# EAGLE design bottom_board_v6 (EAGLE 9.6.2)
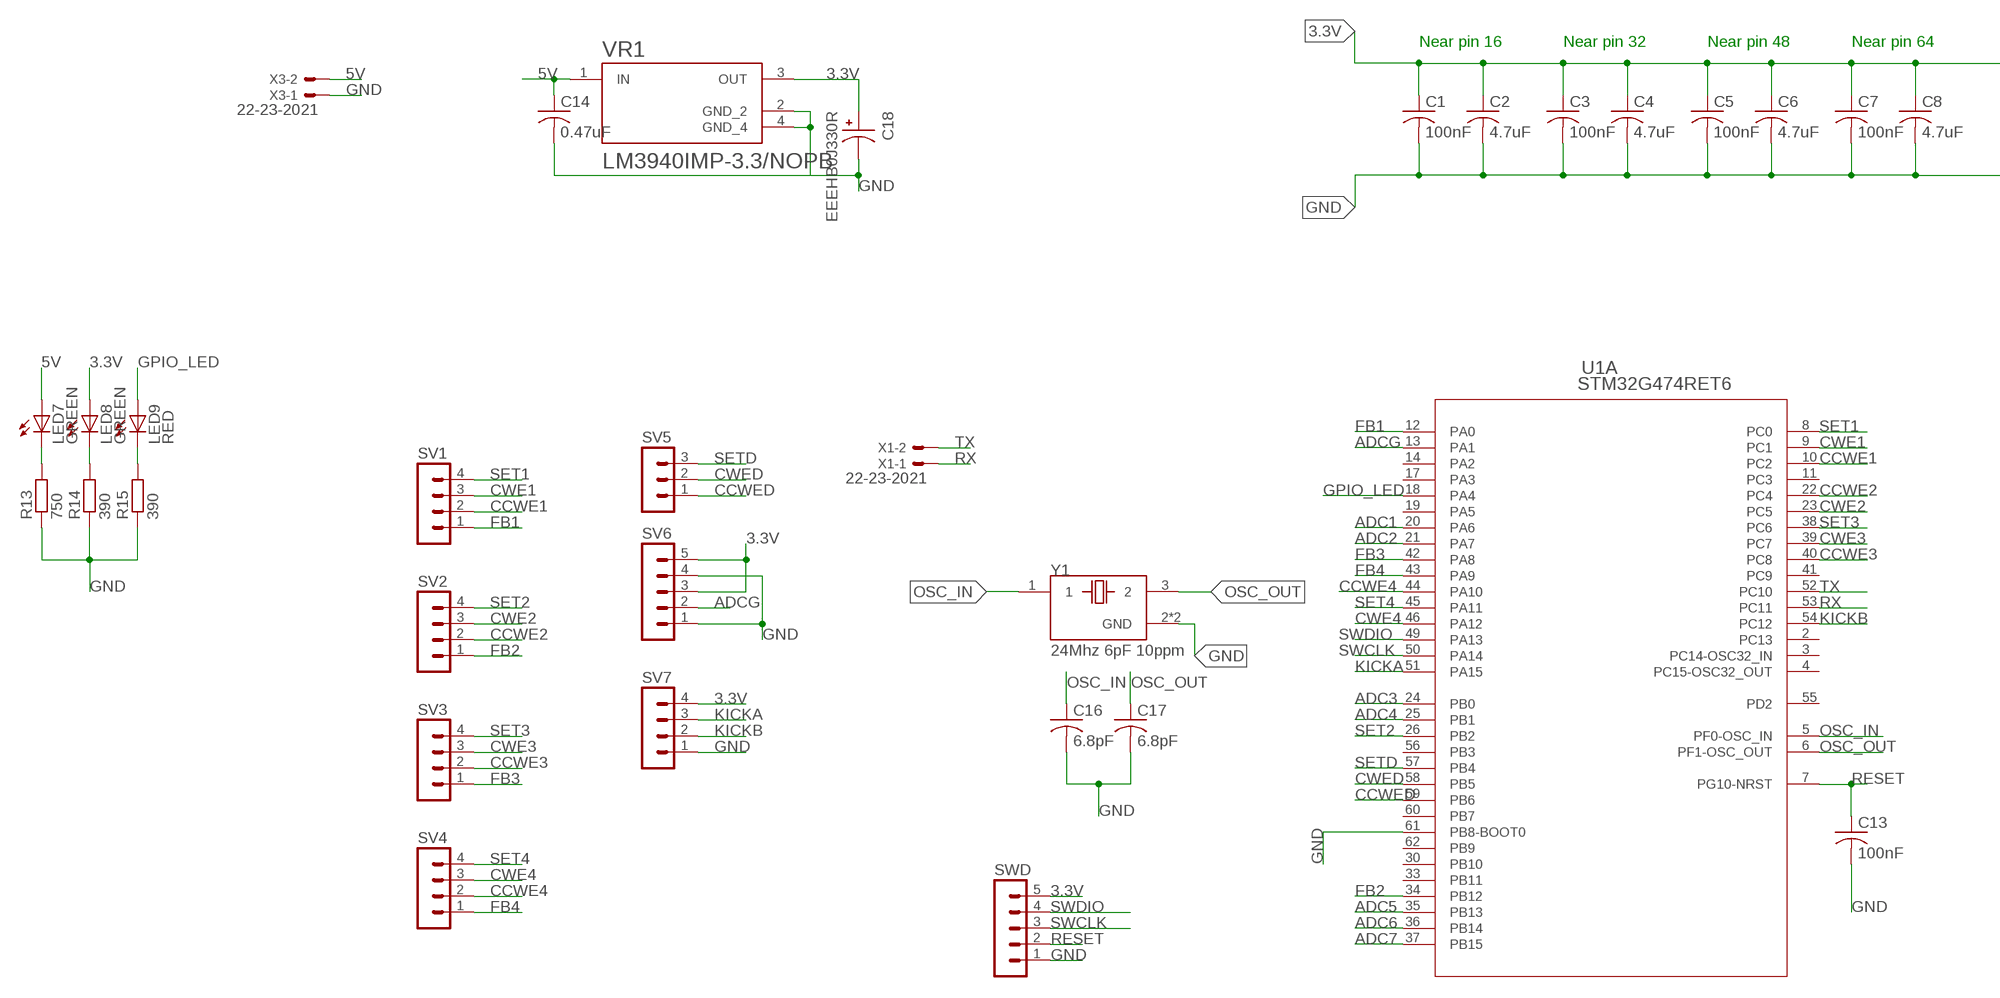
[diagram p0: schematic, sheet 1, part 1 of 2]
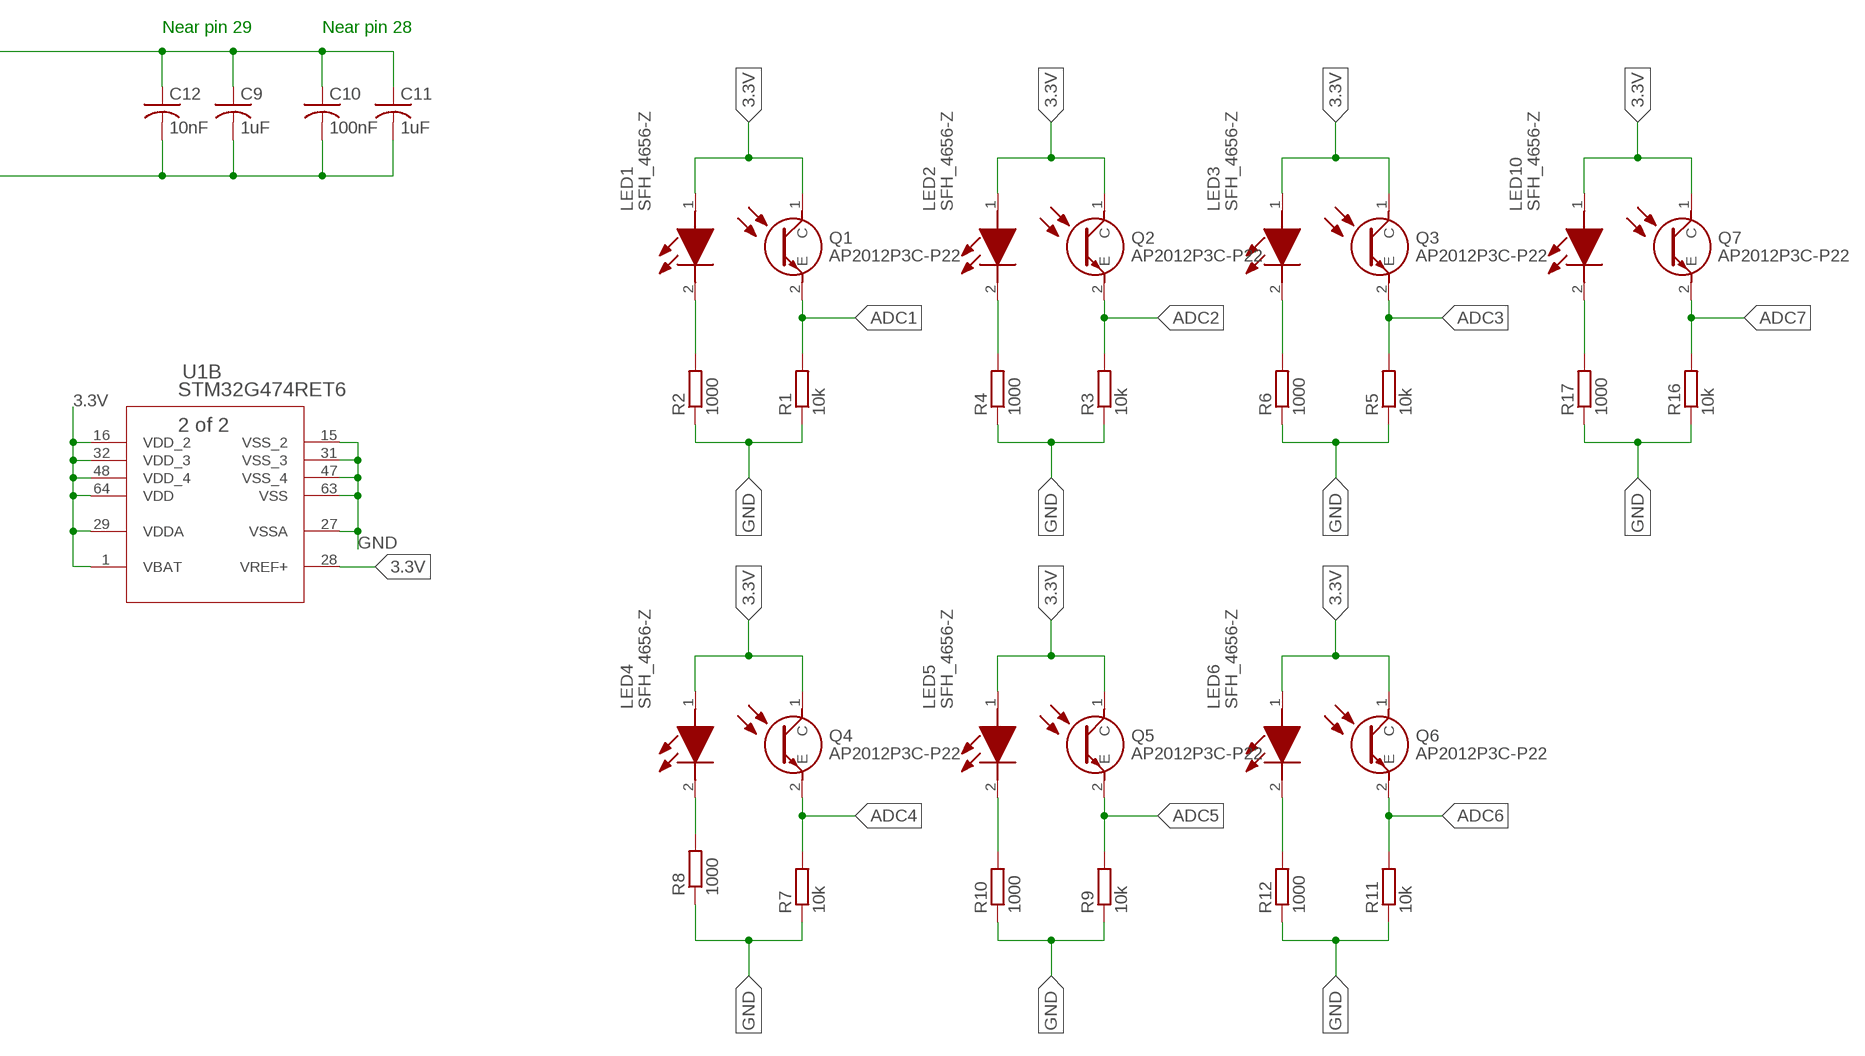
[diagram p1: schematic, sheet 1, part 2 of 2]

## Parts
C1  100nF  C-USC0603  [C0603]
C2  4.7uF  C-USC0603  [C0603]
C3  100nF  C-USC0603  [C0603]
C4  4.7uF  C-USC0603  [C0603]
C5  100nF  C-USC0603  [C0603]
C6  4.7uF  C-USC0603  [C0603]
C7  100nF  C-USC0603  [C0603]
C8  4.7uF  C-USC0603  [C0603]
C9  1uF  C-USC0603  [C0603]
C10  100nF  C-USC0603  [C0603]
C11  1uF  C-USC0603  [C0603]
C12  10nF  C-USC0603  [C0603]
C13  100nF  C-USC0603  [C0603]
C14  0.47uF  C-USC0603  [C0603]
C16  6.8pF  C-USC0603  [C0603]
C17  6.8pF  C-USC0603  [C0603]
C18  EEEHB0J330R  [CAP_EEEHB0J330R]
LED1  SFH_4656-Z  [SFH4656Z]
LED2  SFH_4656-Z  [SFH4656Z]
LED3  SFH_4656-Z  [SFH4656Z]
LED4  SFH_4656-Z  [SFH4656Z]
LED5  SFH_4656-Z  [SFH4656Z]
LED6  SFH_4656-Z  [SFH4656Z]
LED7  GREEN  LEDCHIPLED_0603  [CHIPLED_0603]
LED8  GREEN  LEDCHIPLED_0603  [CHIPLED_0603]
LED9  RED  LEDCHIPLED_0603  [CHIPLED_0603]
LED10  SFH_4656-Z  [SFH4656Z]
Q1  AP2012P3C-P22  [AP2012P3CP22]
Q2  AP2012P3C-P22  [AP2012P3CP22]
Q3  AP2012P3C-P22  [AP2012P3CP22]
Q4  AP2012P3C-P22  [AP2012P3CP22]
Q5  AP2012P3C-P22  [AP2012P3CP22]
Q6  AP2012P3C-P22  [AP2012P3CP22]
Q7  AP2012P3C-P22  [AP2012P3CP22]
R1  10k  R-EU_R0603  [R0603]
R2  1000  R-EU_R0603  [R0603]
R3  10k  R-EU_R0603  [R0603]
R4  1000  R-EU_R0603  [R0603]
R5  10k  R-EU_R0603  [R0603]
R6  1000  R-EU_R0603  [R0603]
R7  10k  R-EU_R0603  [R0603]
R8  1000  R-EU_R0603  [R0603]
R9  10k  R-EU_R0603  [R0603]
R10  1000  R-EU_R0603  [R0603]
R11  10k  R-EU_R0603  [R0603]
R12  1000  R-EU_R0603  [R0603]
R13  750  R-EU_R0603  [R0603]
R14  390  R-EU_R0603  [R0603]
R15  390  R-EU_R0603  [R0603]
R16  10k  R-EU_R0603  [R0603]
R17  1000  R-EU_R0603  [R0603]
SV1  MA04-1  [MA04-1]
SV2  MA04-1  [MA04-1]
SV3  MA04-1  [MA04-1]
SV4  MA04-1  [MA04-1]
SV5  MA03-1  [MA03-1]
SV6  MA05-1  [MA05-1]
SV7  MA04-1  [MA04-1]
SWD  MA05-1  [MA05-1]
U1  STM32G474RET6  [LQFP64-10X10MM]
VR1  LM3940IMP-3.3/NOPB  [VREG_LM3940IMP-3.3/NOPB]
X1  22-23-2021  [22-23-2021]
X3  22-23-2021  [22-23-2021]
Y1  24Mhz 6pF 10ppm  TSX-3225_16.0000MF18X-AC3  [XTAL_TSX-3225_16.0000MF18X-AC3]

## Nets
3.3V: C1.1 C2.1 C3.1 C4.1 C5.1 C6.1 C7.1 C8.1 C9.1 C10.1 C11.1 C12.1 C18.1 LED1.1(A) LED2.1(A) LED3.1(A) LED4.1(A) LED5.1(A) LED6.1(A) LED8.A LED10.1(A) Q1.1(C) Q2.1(C) Q3.1(C) Q4.1(C) Q5.1(C) Q6.1(C) Q7.1(C) SV6.3 SV6.5 SV7.4 SWD.5 U1.1(B:VBAT) U1.16(B:VDD_2) U1.28(B:VREF+) U1.29(B:VDDA) U1.32(B:VDD_3) U1.48(B:VDD_4) U1.64(B:VDD) VR1.3(OUT)
5V: C14.1 LED7.A VR1.1(IN) X3.2
ADC1: Q1.2(E) R1.2 U1.20(A:PA6)
ADC2: Q2.2(E) R3.2 U1.21(A:PA7)
ADC3: Q3.2(E) R5.2 U1.24(A:PB0)
ADC4: Q4.2(E) R7.2 U1.25(A:PB1)
ADC5: Q5.2(E) R9.2 U1.35(A:PB13)
ADC6: Q6.2(E) R11.2 U1.36(A:PB14)
ADC7: Q7.2(E) R16.2 U1.37(A:PB15)
ADCG: SV6.2 U1.13(A:PA1)
CCWE1: SV1.2 U1.10(A:PC2)
CCWE2: SV2.2 U1.22(A:PC4)
CCWE3: SV3.2 U1.40(A:PC8)
CCWE4: SV4.2 U1.44(A:PA10)
CCWED: SV5.1 U1.59(A:PB6)
CWE1: SV1.3 U1.9(A:PC1)
CWE2: SV2.3 U1.23(A:PC5)
CWE3: SV3.3 U1.39(A:PC7)
CWE4: SV4.3 U1.46(A:PA12)
CWED: SV5.2 U1.58(A:PB5)
FB1: SV1.1 U1.12(A:PA0)
FB2: SV2.1 U1.34(A:PB12)
FB3: SV3.1 U1.42(A:PA8)
FB4: SV4.1 U1.43(A:PA9)
GND: C1.2 C2.2 C3.2 C4.2 C5.2 C6.2 C7.2 C8.2 C9.2 C10.2 C11.2 C12.2 C13.2 C14.2 C16.2 C17.2 C18.2 R1.1 R2.1 R3.1 R4.1 R5.1 R6.1 R7.1 R8.1 R9.1 R10.1 R11.1 R12.1 R13.1 R14.1 R15.1 R16.1 R17.1 SV6.1 SV6.4 SV7.1 SWD.1 U1.15(B:VSS_2) U1.27(B:VSSA) U1.31(B:VSS_3) U1.47(B:VSS_4) U1.61(A:PB8-BOOT0) U1.63(B:VSS) VR1.2(GND_2) VR1.4(GND_4) X3.1 Y1.2(GND) Y1.4(GND)
GPIO_LED: LED9.A U1.18(A:PA4)
KICKA: SV7.3 U1.51(A:PA15)
KICKB: SV7.2 U1.54(A:PC12)
N$1: LED2.2(K) R4.2
N$2: LED3.2(K) R6.2
N$3: LED1.2(K) R2.2
N$4: LED4.2(K) R8.2
N$5: LED5.2(K) R10.2
N$6: LED6.2(K) R12.2
N$7: LED7.C R13.2
N$8: LED8.C R14.2
N$9: LED9.C R15.2
N$10: LED10.2(K) R17.2
OSC_IN: C16.1 U1.5(A:PF0-OSC_IN) Y1.1
OSC_OUT: C17.1 U1.6(A:PF1-OSC_OUT) Y1.3
RESET: C13.1 SWD.2 U1.7(A:PG10-NRST)
RX: U1.53(A:PC11) X1.1
SET1: SV1.4 U1.8(A:PC0)
SET2: SV2.4 U1.26(A:PB2)
SET3: SV3.4 U1.38(A:PC6)
SET4: SV4.4 U1.45(A:PA11)
SETD: SV5.3 U1.57(A:PB4)
SWCLK: SWD.3 U1.50(A:PA14)
SWDIO: SWD.4 U1.49(A:PA13)
TX: U1.52(A:PC10) X1.2
Unconnected: U1.2(A:PC13) U1.3(A:PC14-OSC32_IN) U1.4(A:PC15-OSC32_OUT) U1.11(A:PC3) U1.14(A:PA2) U1.17(A:PA3) U1.19(A:PA5) U1.30(A:PB10) U1.33(A:PB11) U1.41(A:PC9) U1.55(A:PD2) U1.56(A:PB3) U1.60(A:PB7) U1.62(A:PB9)

## Notes on the sheet
- Near pin 16 | Near pin 32 | Near pin 48 | Near pin 64 | Near pin 29 | Near pin 28

## Library data of the parts
C1-C14 C16 C17 = adafruit:C-US: CAPACITOR, American symbol
C18 = EEEHB0J330R:EEEHB0J330R: Check availability <https://pricing.snapeda.com/parts/EEE-HB0J330R/Panasonic/view-part?ref=eda>; AVAILABILITY: In Stock; CHECK_PRICES: https://www.snapeda.com/parts/EEE-HB0J330R/Panasonic/view-part/?ref=eda; DESCRIPTION: Capacitor,Alum Electrolytic,Cap 33 uF,Tol 20%,Vol-Rtg 6.3 VDC,SMT,4x5.8,TR | Panasonic Electronic Components EEE-HB0J330R; MF: Panasonic; MP: EEE-HB0J330R; PACKAGE: RADIAL-2 Panasonic; PRICE: None; SNAPEDA_LINK: https://www.snapeda.com/parts/EEE-HB0J330R/Panasonic/view-part/?ref=snap
LED1-LED6 LED10 = SFH_4656-Z:SFH_4656-Z: Infrared Emitters - High Power 850 nm MIDLED Source: Datasheet <https://dammedia.osram.info/media/resource/hires/osram-dam-16623498/SFH 4656_CN.pdf>; DESCRIPTION: Infrared Emitters - High Power 850 nm MIDLED; HEIGHT: 1.7mm; MANUFACTURER_NAME: OSRAM; MANUFACTURER_PART_NUMBER: SFH 4656-Z; MOUSER_PART_NUMBER: 720-SFH4656-Z; MOUSER_PRICE-STOCK: http://www.mouser.com/Search/ProductDetail.aspx?qs=KeLXQb9Uup2X3iF4LUEobw%3d%3d
LED7-LED9 = adafruit:LED: LED OSRAM: - CHIPLED LG R971, LG N971, LY N971, LG Q971, LY Q971, LO R971, LY R971 LH N974, LH R974 LS Q976, LO Q976, LY Q976 LO Q996 - Hyper CHIPLED LW Q18S LB Q993, LB Q99A, LB R99A - SideLED LS A670, LO A670, LY A670, LG A670, LP A670 LB A673, LV A673, LT A673, LW A673 LH A674 LY A675 LS A676, LA A676, LO A676, LY A676, LW A676 LS A679, LY A679, LG A679 - Hyper Micro SIDELED® LS Y876, LA Y876, LO Y876, LY Y876 LT Y87S - SmartLED LW L88C, LW L88S LB L89C, LB L89S, LG L890 LS L89K, LO L89K, LY L89K LS L896, LA L896, LO L896, LY L896 - TOPLED LS T670, LO T670, LY T670, LG T670, LP T670 LSG T670, LSP T670, LSY T670, LOP T670, LYG T670 LG T671, LOG T671, LSG T671 LB T673, LV T673, LT T673, LW T673 LH T674 LS T676, LA T676, LO T676, LY T676, LB T676, LH T676, LSB T676, LW T676 LB T67C, LV T67C, LT T67C, LS T67K, LO T67K, LY T67K, LW E67C LS E67B, LA E67B, LO E67B, LY E67B, LB E67C, LV E67C, LT E67C LW T67C LS T679, LY T679, LG T679 LS T770, LO T770, LY T770, LG T770, LP T770 LB T773, LV T773, LT T773, LW T773 LH T774 LS E675, LA E675, LY E675, LS T675 LS T776, LA T776, LO T776, LY T776, LB T776 LHGB T686 LT T68C, LB T68C - Hyper Mini TOPLED® LB M676 - Mini TOPLED Santana® LG M470 LS M47K, LO M47K, LY M47K Source: http://www.osram.convergy.de/
Q1-Q7 = AP2012P3C-P22:AP2012P3C-P22: Phototransistors 2x1.2mm PHOTOTRANS SMD LED Source: Datasheet <http://www.kingbrightusa.com/images/catalog/SPEC/AP2012P3C-P22.pdf>; ARROW_PART_NUMBER: AP2012P3C-P22; ARROW_PRICE-STOCK: https://www.arrow.com/en/products/ap2012p3c-p22/kingbright; DESCRIPTION: Phototransistors 2x1.2mm PHOTOTRANS SMD LED; HEIGHT: 1.1mm; MANUFACTURER_NAME: Kingbright; MANUFACTURER_PART_NUMBER: AP2012P3C-P22; MOUSER_PART_NUMBER: 604-AP2012P3C-P22; MOUSER_PRICE-STOCK: https://www.mouser.com/Search/Refine.aspx?Keyword=604-AP2012P3C-P22
R1-R17 = rcl:R-EU_: RESISTOR, European symbol; SPICEPREFIX: R
SV1-SV4 SV7 = con-lstb:MA04-1: PIN HEADER; OC_FARNELL: unknown; OC_NEWARK: unknown
SV5 = con-lstb:MA03-1: PIN HEADER; OC_FARNELL: unknown; OC_NEWARK: unknown
SV6 SWD = con-lstb:MA05-1: PIN HEADER; OC_FARNELL: unknown; OC_NEWARK: unknown
U1 = STM32G474RET6:STM32G474RET6; COPYRIGHT: Copyright (C) 2023 Ultra Librarian. All rights reserved.; MANUFACTURER_PART_NUMBER: STM32G474RET6; MFR_NAME: STMicroelectronics
VR1 = LM3940IMP-3.3_NOPB:LM3940IMP-3.3/NOPB: 1-A, low-dropout voltage regulator for 5-V to 3.3-V conversion 4-SOT-223 -40 to 125 Check availability <https://pricing.snapeda.com/parts/LM3940IMP-3.3/Texas%20Instruments/view-part?ref=eda>; AVAILABILITY: In Stock; CHECK_PRICES: https://www.snapeda.com/parts/LM3940IMP-3.3/Texas+Instruments/view-part/?ref=eda; DESCRIPTION: 1-A, low-dropout voltage regulator for 5-V to 3.3-V conversion 4-SOT-223 -40 to 125; MF: Texas Instruments; MP: LM3940IMP-3.3; PACKAGE: SOT-223-4 Texas Instruments; PRICE: None; PURCHASE-URL: https://www.snapeda.com/api/url_track_click_mouser/?unipart_id=50710&manufacturer=Texas Instruments&part_name=LM3940IMP-3.3&search_term=None; SNAPEDA_LINK: https://www.snapeda.com/parts/LM3940IMP-3.3/Texas+Instruments/view-part/?ref=snap
X1 X3 = con-molex:22-23-2021: .100" (2.54mm) Center Header - 2 Pin; MF: MOLEX; MPN: 22-23-2021; OC_FARNELL: 1462926; OC_NEWARK: 25C3832
Y1 = SMD3225:TSX-3225_16.0000MF18X-AC3: SMD Crystal 16MHz-9pF-10ppm-60R; Check availability <https://pricing.snapeda.com/parts/TSX-3225%2016.0000MF18X-AC3/EPSON/view-part?ref=eda>; AVAILABILITY: In Stock; CHECK_PRICES: https://www.snapeda.com/parts/TSX-3225%2016.0000MF18X-AC3/EPSON/view-part/?ref=eda; DESCRIPTION: 16 MHz ±10ppm Crystal 9pF 60 Ohms 4-SMD, No Lead; MF: EPSON; MP: TSX-3225 16.0000MF18X-AC3; PACKAGE: SMD-4 EPSON; PRICE: None; PURCHASE-URL: https://www.snapeda.com/api/url_track_click_mouser/?unipart_id=105674&manufacturer=EPSON&part_name=TSX-3225 16.0000MF18X-AC3&search_term=None; SNAPEDA_LINK: https://www.snapeda.com/parts/TSX-3225%2016.0000MF18X-AC3/EPSON/view-part/?ref=snap

## Board
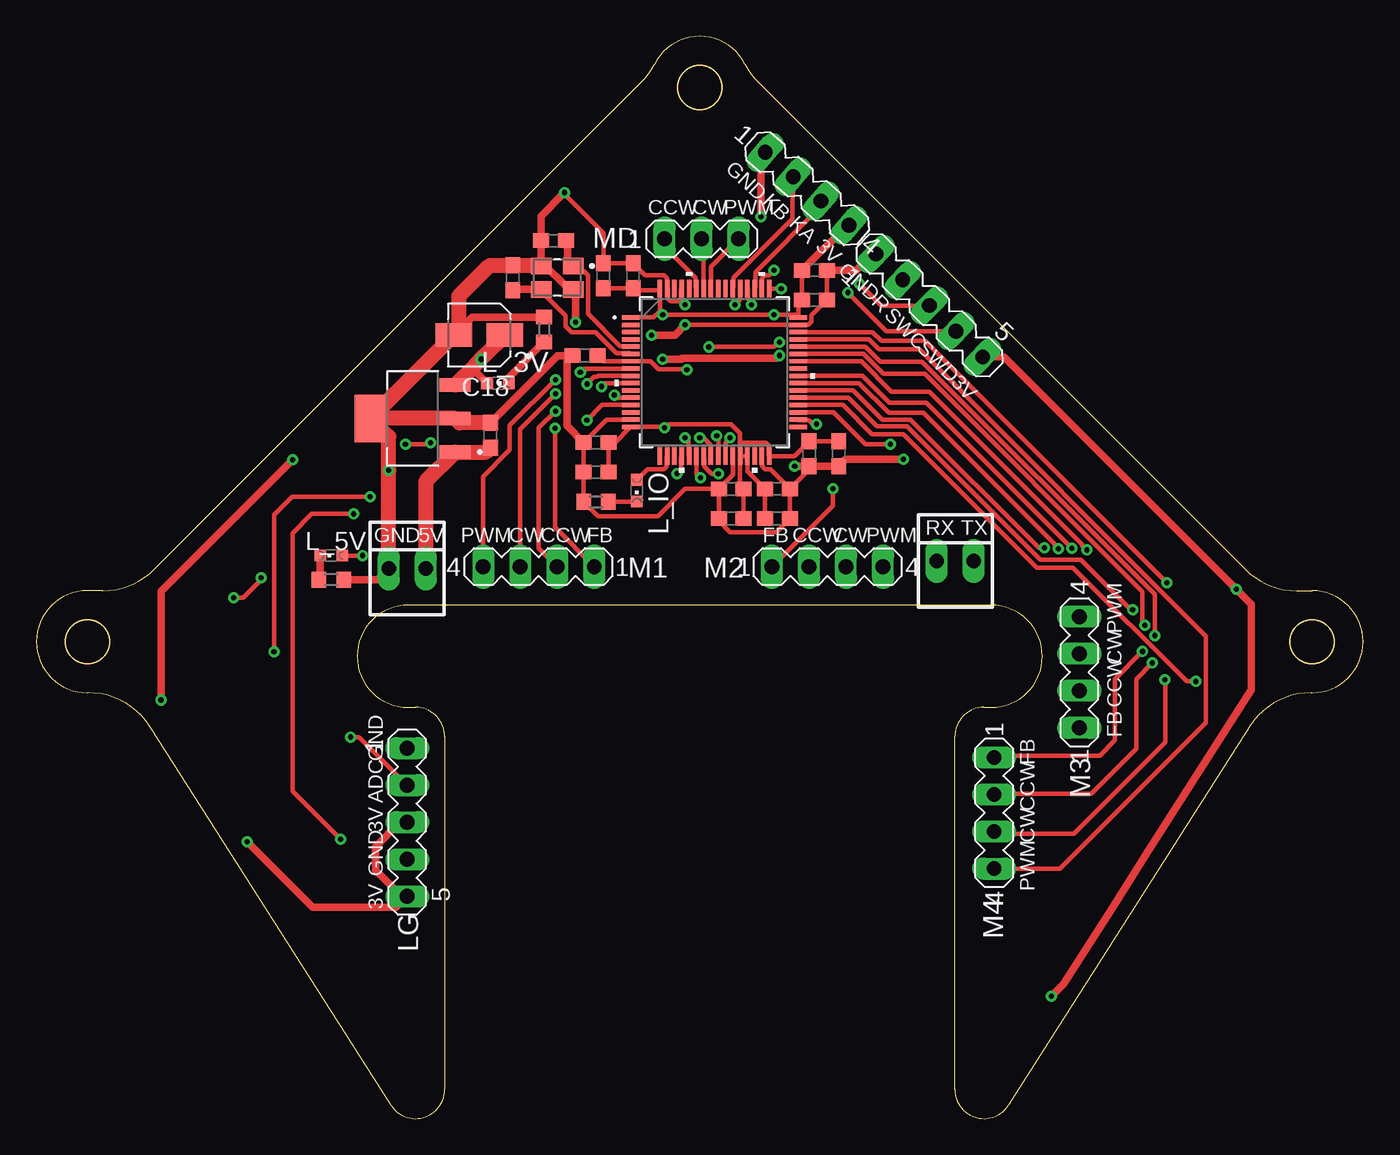
[diagram p2: board, top side]
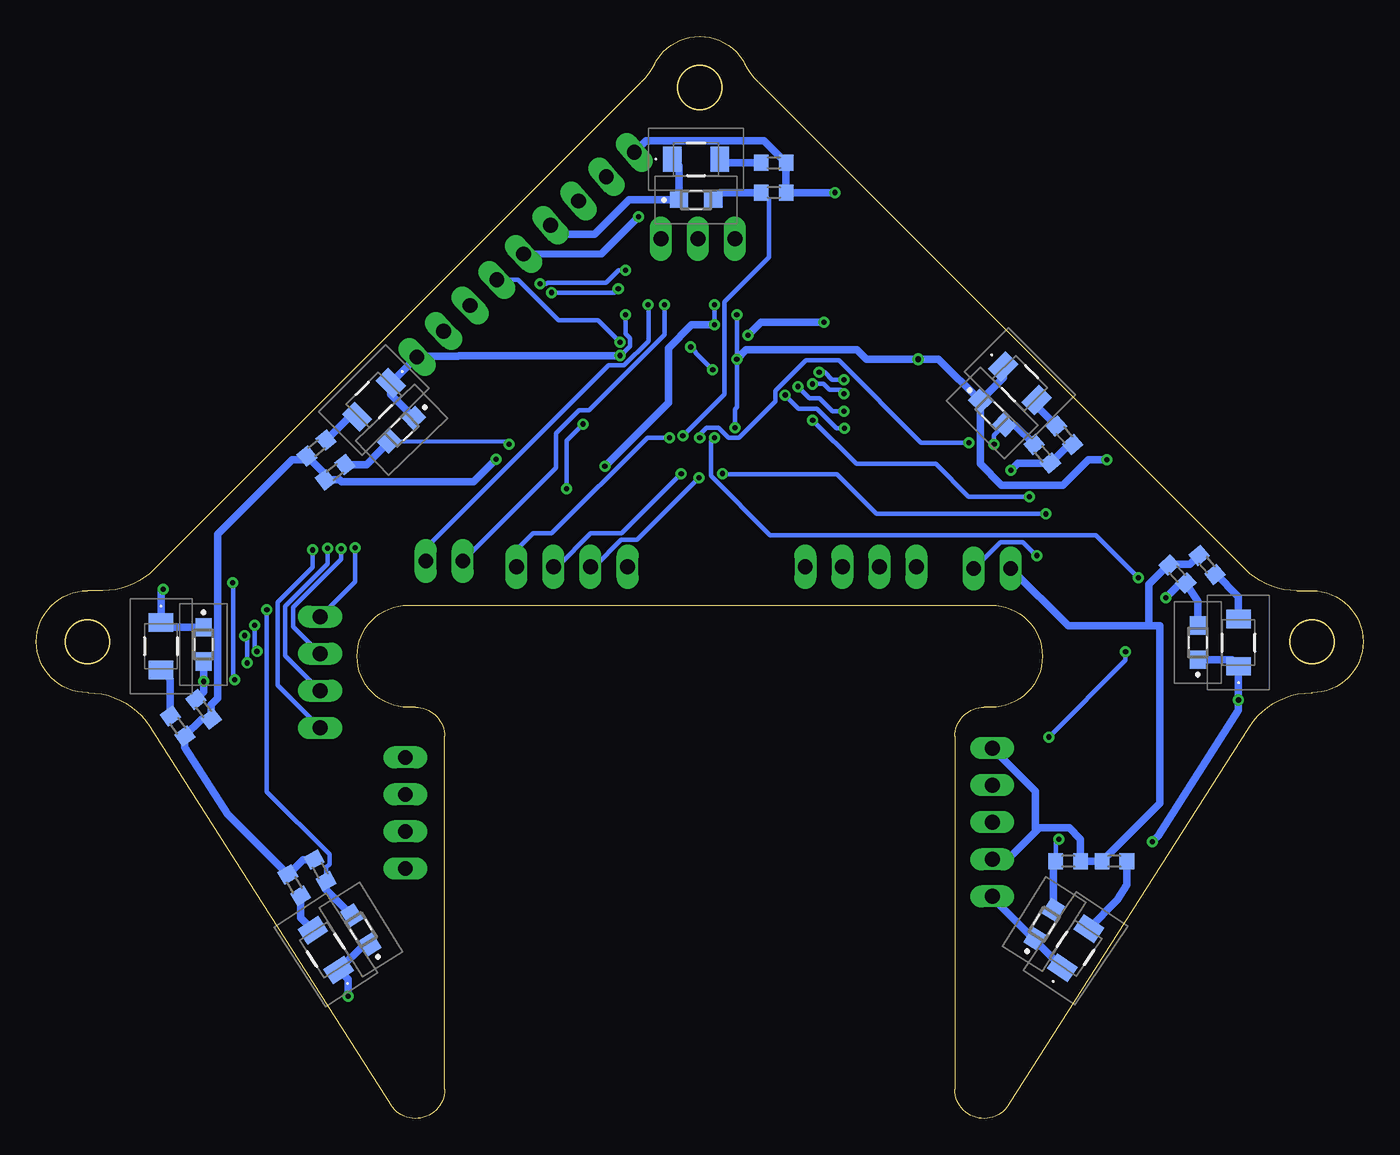
[diagram p3: board, bottom side, seen from below]

Size 91 x 74.2 mm. Coordinates in mm from the lower left corner, seen from the top.
Outline: 41.48,71.05 8.09,37.66 arc-45 4.55,36.2 3.5,36.2 arc180 3.5,29.2 3.56,29.2 arc-58 7.77,26.89 24.31,0.93 arc148 28,2 28,26.2 arc90 26,28.2 25.5,28.2 arc-180 25.5,35.2 65.5,35.2 arc-180 65.5,28.2 65,28.2 arc90 63,26.2 63,2 arc148 66.69,0.93 83.22,26.89 arc-58 87.44,29.2 87.5,29.2 arc180 87.5,36.2 86.44,36.2 arc-45 82.91,37.66 49.52,71.05 arc-18 48.61,72.3 arc126 42.39,72.3 arc-18 41.48,71.05
Outline: circle at 3.5,32.7 radius 1.5
Outline: circle at 45.5,70.7 radius 1.5
Outline: circle at 87.5,32.7 radius 1.5
Copper layers (1*16): Top 0.035mm / dielectric 1.5mm / Bottom 0.035mm
Design rules "default": minimum track width 6mil, minimum drill 0.35mm, track to track 6mil, track to pad 6mil, pad to pad 6mil, via to via 6mil, smd to smd 6mil, copper to edge 40mil, drill to drill 6mil, minimum pad ring 10mil, minimum via ring 8mil, stop-mask expansion 4mil, vias tented up to drill 0mil, thermal gap 10mil

### Footprints (pad centres in the part's own frame; a part is rotated, then mirrored left to right if it is on the bottom)
C0603 = smd 1.1 x 1: 1 -0.85,0; 2 0.85,0
CAP_EEEHB0J330R = smd 2.5 x 1.6: 1 -1.75,0; 2 1.75,0
SFH4656Z = smd 1.25 x 1.7: 1 -1.625,0; 2 1.625,0
CHIPLED_0603 = smd 0.8 x 0.8: A 0,-0.75; C 0,0.75
AP2012P3CP22 = smd 1.25 x 1.1: 1 -1.175,0; 2 1.175,0
R0603 = smd 1 x 1.1: 1 -0.85,0; 2 0.85,0
MA04-1 = drill 1.016 long: 1 -3.81,0; 2 -1.27,0; 3 1.27,0; 4 3.81,0
MA03-1 = drill 1.016 long: 1 -2.54,0; 2 0,0; 3 2.54,0
MA05-1 = drill 1.016 long: 1 -5.08,0; 2 -2.54,0; 3 0,0; 4 2.54,0; 5 5.08,0
LQFP64-10X10MM = smd 1.194 x 0.305: 1 -5.75,3.75; 2 -5.75,3.25; 3 -5.75,2.75; 4 -5.75,2.25; 5 -5.75,1.75; 6 -5.75,1.25; 7 -5.75,0.75; 8 -5.75,0.25; 9 -5.75,-0.25; 10 -5.75,-0.75; 11 -5.75,-1.25; 12 -5.75,-1.75; 13 -5.75,-2.25; 14 -5.75,-2.75; 15 -5.75,-3.25; 16 -5.75,-3.75; 33 5.75,-3.75; 34 5.75,-3.25; 35 5.75,-2.75; 36 5.75,-2.25; 37 5.75,-1.75; 38 5.75,-1.25; 39 5.75,-0.75; 40 5.75,-0.25; 41 5.75,0.25; 42 5.75,0.75; 43 5.75,1.25; 44 5.75,1.75; 45 5.75,2.25; 46 5.75,2.75; 47 5.75,3.25; 48 5.75,3.75 | smd 0.305 x 1.194: 17 -3.75,-5.75; 18 -3.25,-5.75; 19 -2.75,-5.75; 20 -2.25,-5.75; 21 -1.75,-5.75; 22 -1.25,-5.75; 23 -0.75,-5.75; 24 -0.25,-5.75; 25 0.25,-5.75; 26 0.75,-5.75; 27 1.25,-5.75; 28 1.75,-5.75; 29 2.25,-5.75; 30 2.75,-5.75; 31 3.25,-5.75; 32 3.75,-5.75; 49 3.75,5.75; 50 3.25,5.75; 51 2.75,5.75; 52 2.25,5.75; 53 1.75,5.75; 54 1.25,5.75; 55 0.75,5.75; 56 0.25,5.75; 57 -0.25,5.75; 58 -0.75,5.75; 59 -1.25,5.75; 60 -1.75,5.75; 61 -2.25,5.75; 62 -2.75,5.75; 63 -3.25,5.75; 64 -3.75,5.75
VREG_LM3940IMP-3.3/NOPB = smd 2.15 x 0.95: 1 -2.9,2.3; 2 -2.9,0; 3 -2.9,-2.3 | smd 2.15 x 3.25: 4 2.9,0
22-23-2021 = drill 1 long: 1 -1.27,0; 2 1.27,0
XTAL_TSX-3225_16.0000MF18X-AC3 = smd 1.4 x 1.15: 1 -1.1,-0.8; 2 1.1,-0.8; 3 1.1,0.8; 4 -1.1,0.8

### Placement (x,y rotation side)
C1  38.39,44.32 180 top
C2  38.39,46.35 180 top
C3  55.02,45.59 270 top
C4  52.99,45.59 270 top
C5  53.37,58.16 0 top
C6  53.37,56.13 0 top
C7  38.9,57.78 90 top
C8  40.93,57.78 90 top
C9  50.83,43.18 0 top
C10  50.83,41.14 0 top
C11  47.66,41.14 180 top
C12  47.66,43.18 180 top
C13  37.63,52.32 180 top
C14  31.15,46.86 90 top
C16  35.47,60.19 180 top
C17  32.67,57.65 90 top
C18  30.39,53.72 180 top
LED1  19.72,11.68 56 bottom
LED2  8.54,32.64 90 bottom
LED3  23.53,50.42 315 bottom
LED4  45.75,65.78 0 bottom
LED5  67.85,49.27 225 bottom
LED6  82.46,32.38 270 bottom
LED7  20.23,38.6 90 top
LED8  31.66,50.42 270 top
LED9  41.18,43.05 180 top
LED10  71.15,11.55 123 bottom
Q1  21.88,13.33 58 bottom
Q2  11.34,32.64 90 bottom
Q3  25.43,48.38 315 bottom
Q4  45.75,62.99 0 bottom
Q5  65.95,47.24 224 bottom
Q6  79.54,32.51 270 bottom
Q7  68.74,12.95 122 bottom
R1  20.23,17.65 180 bottom
R2  17.05,17.65 0 bottom
R3  12.73,37.33 313 bottom
R4  10.7,37.97 310 bottom
R5  22,45.59 131 bottom
R6  20.48,46.86 131 bottom
R7  40.42,63.5 180 bottom
R8  40.42,65.53 180 bottom
R9  70.52,44.32 38 bottom
R10  71.79,45.97 40 bottom
R11  79.54,28.06 128 bottom
R12  81.31,26.92 126 bottom
R13  20.23,36.95 180 top
R14  34.83,54.1 270 top
R15  38.39,42.29 0 top
R16  71.53,17.01 299 bottom
R17  73.31,16 301 bottom
SV1  34.45,37.84 180 top
SV2  54.26,37.84 0 top
SV3  71.53,30.6 90 top
SV4  65.69,20.95 270 top
SV5  45.63,60.32 0 top
SV6  25.43,20.32 270 top
SV7  52.87,63.75 319 top
SWD  61.25,55.75 316 top
U1  46.52,51.18 0 top
VR1  25.82,48 180 top
X1  63.03,38.22 0 top
X3  25.43,37.72 0 top
Y1  35.72,57.65 180 top

### Tracks (layer width: path | path; a pad name or v marks a point on that pad's centre or on a via)
3.3V  (via drill 0.35, 0.4)
  Top 0.305: C1.1 C2.1 39.69,46.35 U1.16 43.03,47.43 v43.09,47.37 43.34,47.62 47.64,47.62 48.27,47 48.27,46.36 | 48.27,46.36 U1.28 | U1.28 U1.29 48.77,44.39 C9.1 C10.1 | C11.1 C12.1 48.26,43.43 48.26,45.42 U1.28 | 48.27,46.36 48.3,46.33 50.05,46.33 50.22,46.15 50.22,45.47 U1.32 51.98,45.43 C4.1 C3.1 | 42.77,55.37 42.77,55.31 v42.96,55.11 v50.58,55.11 52.08,55.11 U1.48 52.27,55.87 C6.1 C5.1 | 42.77,55.37 U1.64 42.64,56.8 41.06,56.8 C8.1 C7.1 | 42.77,55.37 42.33,54.93 U1.1
  Top 0.508: v8.54,28.7 8.54,36.14 v17.58,45.18 | SV7.4 55.62,61.26 C5.1 | v42.96,52.07 44.23,52.07 44.29,52.12 50.76,52.12 v50.96,52.32 | SWD.5 66.39,52.21 v82.31,36.29 83.32,35.28 83.32,29.4 78.16,21.31 76.28,18.35 73.82,14.49 70.45,9.2 v69.63,8.38 | SV6.3 24.93,20.32 23.25,18.64 23.25,17.04 25.05,15.24 SV6.5 24.68,14.49 18.96,14.49 v14.46,18.99 | LED8.A 30.12,51.2 30.12,51.7 | v30.51,52.07 30.51,52.09 30.75,52.33
  Top 1.016: VR1.3 28.72,50.3 30.12,51.7 30.75,52.33 C18.1
  Bottom 0.305: v42.96,55.11 v42.96,52.07 42.96,48.76 43.09,48.64 v43.09,47.37 | v50.96,52.32 50.73,52.55 50.68,52.55 50.28,52.95 50.28,53.51 50.58,53.81 v50.58,55.11
  Bottom 0.508: LED1.1 22.5,12.21 | 22.5,12.21 Q1.1 | 20.79,10.16 LED1.1 | v14.46,18.99 14.05,19.4 8.56,28.01 | 8.56,28.01 | 8.56,28.01 8.54,28.03 v8.54,28.7 LED2.1 8.99,31.46 Q2.1 | Q3.1 24.68,50.8 LED3.1 | v17.58,45.18 18.85,45.18 20.61,43.43 24.8,43.43 26.27,44.9 Q3.1 | Q3.1 29.12,52.07 v30.51,52.07 34.07,52.07 34.7,52.7 42.33,52.7 v42.96,52.07 | Q7.1 68.5,11.96 LED10.1 69.63,9.55 v69.63,8.38 | LED4.1 46.93,65.33 Q4.1 50.36,62.99 52.7,60.64 55.08,60.64 SV7.4 | v50.96,52.32 62,52.32 62.07,52.26 64.84,52.26 SWD.5 64.92,52.21 LED5.1 66.7,49.66 Q5.1 | Q6.1 82.13,33.68 LED6.1 82.46,36.14 v82.31,36.29 | 20.62,9.89 LED1.1 | SV6.5 25.43,15.14 22.5,12.21
5V  (via drill 0.35)
  Top 0.305: LED7.A v22.39,38.6
  Top 1.016: X3.2 26.7,43.69 VR1.1 30.84,45.7 C14.1
  Bottom 0.305: v22.39,38.6 22.42,38.6 23.34,39.53 24.89,39.53 X3.2
ADC1  (via drill 0.35)
  Top 0.305: v43.94,44.23 44.22,44.51 44.22,45.38 U1.20 | v20.86,19.15 17.56,22.45 17.56,40.13 18.89,41.45 v21.75,41.45
  Bottom 0.305: R1.2 21.08,18.94 v20.86,19.15 | v21.75,41.45 33.36,41.45 36.1,44.19 43.9,44.19 v43.94,44.23
  Bottom 0.508: Q1.2 21.25,17.47 R1.2
ADC2  (via drill 0.35)
  Top 0.305: v13.54,35.7 14.18,35.7 15.4,36.93 v15.4,37.09 | v44.48,46.68 44.74,46.43 44.74,45.46 U1.21
  Bottom 0.305: v15.4,37.09 18.32,40.01 40.69,40.01 44.74,44.06 44.74,46.43 v44.48,46.68
  Bottom 0.508: Q2.2 11.34,35.48 R3.2 12.53,36.71 v13.54,35.7
ADC3  (via drill 0.35)
  Top 0.305: v25.31,46.22 26.92,46.22 v27.05,46.35 | v45.5,46.68 45.75,46.68 46.27,46.17 U1.24
  Bottom 0.305: Q3.2 25.31,46.85 v25.31,46.22 | v27.05,46.35 30.33,46.35 35.96,51.99 38.23,51.99 40.32,49.89 40.32,49.17 42.8,46.68 43.52,46.68 44.2,47.37 45.02,47.37 45.5,46.89 v45.5,46.68
  Bottom 0.508: R5.2 23.88,47.55 Q3.2
ADC4  (via drill 0.35)
  Top 0.305: U1.25 46.79,45.45 46.79,46.68 v46.66,46.81
  Bottom 0.305: R7.2 40.76,62.99 40.76,59.06 43.82,56 43.82,49.66 v46.66,46.81
  Bottom 0.508: R7.2 44.07,63.5 Q4.2
ADC5  (via drill 0.35)
  Top 0.305: v58.58,46.22 56.88,46.22 54.68,48.43 U1.35
  Bottom 0.305: Q5.2 58.77,46.42 v58.58,46.22
  Bottom 0.508: R9.2 68.36,44.84 Q5.2
ADC6  (via drill 0.35)
  Top 0.305: v79.54,29.97 78.9,29.97 71.09,37.78 68.61,37.78 59.47,46.92 57.32,46.92 55.32,48.93 U1.36
  Bottom 0.508: R11.2 79.54,29.26 v79.54,29.97 Q6.2
ADC7  (via drill 0.35)
  Top 0.305: U1.37 55.71,49.43 57.67,47.47 59.72,47.47 68.87,38.33 71.64,38.33 75.07,34.9 v75.19,34.9
  Bottom 0.305: 71.12,16 71.12,17.23 70.9,17.45 70.9,18.11 75.19,22.41 v75.19,34.9
  Bottom 0.508: Q7.2 71.12,15.69 71.12,16 R16.2
ADCG  (via drill 0.35)
  Top 0.305: U1.13 38.8,48.93 v37.75,47.88 | v22.89,42.65 17.54,42.65 16.29,41.4 v16.29,32 | SV6.2 22.13,26.16 v21.55,26.16
  Bottom 0.305: v37.75,47.88 34.77,44.89 29.31,44.89 27.06,42.65 v22.89,42.65 | v21.55,26.16 16.29,31.41 v16.29,32
CCWE1  (via drill 0.35)
  Top 0.305: v38.77,50.19 39,50.43 U1.10 | v35.61,48.51 34.45,47.35 34.45,39.11 SV1.2
  Bottom 0.305: v38.77,50.19 37.97,49.4 37.28,49.4 36.39,48.51 v35.61,48.51
CCWE2  (via drill 0.35)
  Top 0.305: v45.55,43.94 45.27,44.22 U1.22
  Bottom 0.305: v45.55,43.94 49.81,39.67 50.89,39.67 52.72,37.84 SV2.2
CCWE3  (via drill 0.35)
  Top 0.305: U1.40 56.68,50.93 58.51,49.1 61.04,49.1 v71.03,39.11
  Bottom 0.305: SV3.2 73.95,31.75 73.95,35.14 71.03,38.06 v71.03,39.11
CCWE4  (via drill 0.35)
  Top 0.305: SV4.2 65.74,22.27 72.36,22.27 75.44,25.36 75.44,30.12 v76.56,31.24 | U1.44 56.87,52.93 57.9,51.9 60.75,51.9 76.7,35.94 76.7,33.13 v76.72,33.12
  Bottom 0.305: v76.56,31.24 76.56,32.96 v76.72,33.12
CCWED
  Top 0.305: U1.59 45.22,56.97 45.22,57.65 43.09,59.79 SV5.1
CWE1  (via drill 0.35)
  Top 0.305: 37.91,50.49 v37.78,50.37 38.26,50.85 38.45,50.85 38.53,50.93 U1.9 | v35.61,49.7 33.18,47.27 SV1.3
  Bottom 0.305: v37.78,50.37 37.02,50.37 36.61,49.96 35.86,49.96 v35.61,49.7
CWE2  (via drill 0.35)
  Top 0.305: U1.23 45.77,45.21 | 45.77,45.21 45.77,44.81 | 45.77,45.21 45.81,45.17 45.81,44.7 46.31,44.21 v46.77,44.21
  Bottom 0.305: v46.77,44.21 50.85,40.13 52.98,40.13 55.26,37.84 SV2.3
CWE3  (via drill 0.35)
  Top 0.305: U1.39 56.42,50.43 58.47,48.38 60.84,48.38 69.82,39.41 69.82,39.33 v70.09,39.06 70.06,39.09
  Bottom 0.305: SV3.3 73.39,33.73 73.39,35.05 70.09,38.35 v70.09,39.06
CWE4  (via drill 0.35)
  Top 0.305: SV4.3 65.84,19.53 71.15,19.53 77.42,25.8 77.42,30.07 v77.4,30.1 | U1.46 57.36,53.93 57.95,53.34 60.94,53.34 v77.54,36.74
  Bottom 0.305: v77.54,36.74 77.5,36.69 77.5,30.19 v77.4,30.1
CWED
  Top 0.305: U1.58 45.77,60.18 SV5.2
FB1  (via drill 0.35)
  Top 0.305: U1.12 39.82,49.43 v39.64,49.61 | v35.57,47.34 35.57,40.54 SV1.1
  Bottom 0.305: v39.64,49.61 38.71,48.69 37.47,48.69 36.12,47.34 v35.57,47.34
FB2  (via drill 0.35)
  Top 0.305: SV2.1 54.64,42.03 v54.64,43.18 | v53.5,47.62 53.25,47.62 52.99,47.88 52.31,47.88 U1.34
  Bottom 0.305: v54.64,43.18 54.64,46.48 v53.5,47.62
FB3  (via drill 0.35)
  Top 0.305: U1.42 56.58,51.93 58.66,49.84 61.26,49.84 71.71,39.4 71.71,39.32 v72.04,38.99 | v72.04,38.99
  Bottom 0.305: SV3.1 74.46,29.71 74.46,35.4 72.04,37.82 v72.04,38.99
FB4  (via drill 0.35)
  Top 0.305: SV4.1 65.82,24.89 72.93,24.89 73.97,25.93 73.97,30.12 v75.88,32.03 | U1.43 56.72,52.43 58.09,51.06 60.94,51.06 75.88,36.12 75.88,33.96 v76.02,33.82
  Bottom 0.305: v75.88,32.03 76.02,32.17 v76.02,33.82
GND  (via drill 0.35)
  Top 0.305: U1.15 39.11,47.93 C2.2 C1.2 R15.1 38.52,41.31 42.63,41.31 44.5,43.18 C12.2 | 46.64,41.49 46.66,41.51 47.17,41.51 C11.2 | C11.2 C12.2 | U1.27 47.77,44.13 C12.2 | C9.2 50.34,44.53 49.99,44.53 49.77,44.75 U1.31 | C9.2 C10.2 50.75,40.21 47.58,40.21 46.81,40.98 C11.2 | C5.2 C6.2 53.17,55.07 53.17,54.65 52.95,54.43 U1.47 v44.5,54.43 | 36.16,63.43 38.9,60.7 C7.2 C8.2 41.73,57.83 43.05,57.83 43.27,57.61 U1.63 43.31,56.88 43.31,56.2 43.49,56.03 44.05,56.03 44.22,56.2 44.22,56.88 U1.61 44.27,56.03 v44.5,55.8 | C9.2 52.99,44.49 C4.2
  Top 0.508: Y1.2 34.52,58.35 | X3.1 23.4,36.95 R13.1 | C14.2 35.76,52.32 C13.2 36.39,51.94 36.39,47.49 C2.2 | v36.23,63.5 36.16,63.43 34.62,61.88 C16.2 34.62,58.76 36.52,56.85 Y1.4 36.99,56.68 v36.99,54.61 | SWD.1 57.38,59.29 56.26,58.16 C5.2 | v59.47,45.21 55.49,45.21 C3.2 C4.2 v52.01,44.73 | v49.69,61.85 49.69,65.95 SV7.1 | v42.2,53.72 43.79,53.72 v44.5,54.43 | R14.1 29.87,54.95 28.99,54.07
  Top 1.016: X3.1 v24.16,44.45 24.16,46.75 VR1.4 | C14.2 29.01,47.71 VR1.2 VR1.4 | VR1.4 C18.2 28.99,54.07 28.99,56.41 31.09,58.5 C17.2 34.57,58.5 Y1.2
  Bottom 0.305: v44.5,55.8 v44.5,54.43
  Bottom 0.508: R4.1 11.88,37.99 13.31,37.99 R3.1 13.34,38.01 14.71,36.64 14.71,33.78 | R6.1 20.18,46.22 R5.1 23.67,44.94 v24.16,44.45 | R16.1 72.72,17.76 R17.1 77.88,20.86 80.81,25.46 R12.1 79.66,27.39 R11.1 79.02,28.38 78.58,28.81 78.58,40.07 73.47,45.18 72.2,45.18 | v36.23,63.5 R7.1 R8.1 41.08,67.04 49.19,67.04 SV7.1 | 72.2,45.18 71.19,44.17 R9.1 70.2,43.8 70.08,43.68 61,43.68 v59.47,45.21 | 72.2,45.18 R10.1 | SWD.1 52.24,59.29 v49.69,61.85 | SV6.4 24.36,17.78 22.48,19.65 | 22.48,19.65 22.2,19.94 20.16,19.94 19.38,19.16 R1.1 R2.1 13.94,21.61 13.94,33.78 14.71,33.78 | 22.48,19.65 22.48,22.45 SV6.1 | 14.71,33.78 20.23,33.78 X3.1 | v44.5,54.43 46.06,54.43 47.66,52.83 47.66,49.09 v52.01,44.73 | v36.99,54.61 41.31,54.61 v42.2,53.72
GPIO_LED
  Top 0.305: U1.18 43.22,45.38 43.22,44.7 43.05,44.53 41.91,44.53 LED9.A
KICKA
  Top 0.305: U1.51 49.31,56.97 49.31,58.03 53.86,62.58 SV7.3
KICKB
  Top 0.305: U1.54 47.81,56.97 47.81,57.65 51.85,61.69 SV7.2
N$1
  Bottom 0.508: LED2.2 8.54,35.78 10.13,37.37 R4.2
N$2
  Bottom 0.508: R6.2 22.38,48.85 LED3.2
N$3
  Bottom 0.508: LED1.2 16.86,14.99 16.2,16.02 R2.2
N$4
  Bottom 0.508: R8.2 43.88,65.53 LED4.2
N$5
  Bottom 0.508: LED5.2 69.53,48.12 R10.2
N$6
  Bottom 0.508: R12.2 81.81,30.11 LED6.2
N$7
  Top 0.508: LED7.C 19.48,37.05 R13.2
N$8
  Top 0.508: LED8.C 32.41,50.82 R14.2
N$9
  Top 0.305: LED9.C 39.25,42.3 R15.2
N$10
  Bottom 0.508: LED10.2 72.88,13.75 R17.2
OSC_IN
  Top 0.305: U1.5 40.72,52.97 40.04,52.97 37.83,55.19 37.83,57.81 37.18,58.45 Y1.1 36.78,58.45
  Top 0.508: C16.1 36.44,60.07 36.44,58.8 | 36.44,58.8 36.44,58.67 | 36.78,58.45 36.44,58.8
OSC_OUT
  Top 0.305: U1.6 40.72,52.47 39.81,52.47 38.35,53.92 36.71,53.92 36.31,54.32 36.31,55.04 34.62,56.73 Y1.3
  Top 0.508: C17.1 32.67,56.85 Y1.3
RESET  (via drill 0.35)
  Top 0.305: C13.1 38.87,51.93 U1.7 42.13,51.93 42.68,51.38 44.56,51.38 v44.61,51.34 | v46.12,52.9 50.58,52.9 50.68,53 50.73,53 v50.96,53.23
  Bottom 0.305: v44.61,51.34 45.8,52.53 45.8,52.59 v46.12,52.9 | SWD.2 57.95,57.52 55.18,54.75 52.48,54.75 v50.96,53.23
RX  (via drill 0.35)
  Top 0.305: U1.53 48.27,56.15 v47.91,55.8
  Bottom 0.305: X1.1 55.36,44.62 55.36,46.99 53.78,48.56 53.11,48.56 47.91,53.76 v47.91,55.8
SET1  (via drill 0.35)
  Top 0.305: U1.8 37.56,51.43 v37.31,51.18 | v35.61,50.67 32.47,47.53 32.47,45.85 30.64,44.02 SV1.4
  Bottom 0.305: v35.61,50.67 36.42,50.67 36.93,51.18 v37.31,51.18
SET2  (via drill 0.35)
  Top 0.305: U1.26 47.27,46.32 47.35,46.4 47.35,46.46 v47.57,46.68
  Bottom 0.305: v47.57,46.68 49.1,46.68 55.65,40.13 56.93,40.13 58.07,38.99 SV2.4
SET3  (via drill 0.35)
  Top 0.305: U1.38 56.02,49.93 58.02,47.93 59.95,47.93 68.75,39.13 v69.14,39.13
  Bottom 0.305: v69.14,39.13 69.14,36.81 SV3.4
SET4
  Top 0.305: U1.45 57.09,53.43 57.79,52.73 60.55,52.73 80.22,33.07 80.22,27.15 70.22,17.14 SV4.4
SETD
  Top 0.305: U1.57 46.27,58.42 SV5.3
SWCLK  (via drill 0.35)
  Top 0.305: SWD.3 57.95,55.75 v56.45,57.25 56.42,57.27 | v50.58,58.16 50.25,57.83 49.99,57.83 49.77,57.61 U1.50
  Bottom 0.305: v56.45,57.25 56.02,57.25 55.94,57.32 51.93,57.32 51.09,58.16 v50.58,58.16
SWDIO  (via drill 0.35)
  Top 0.305: SWD.4 58.32,53.98 v55.66,56.64 | v51.09,56.89 50.3,56.89 U1.49
  Bottom 0.305: v55.66,56.64 51.34,56.64 v51.09,56.89
TX  (via drill 0.35)
  Top 0.305: U1.52 48.81,56.88 48.81,56.2 49.06,55.96 v49.06,55.8
  Bottom 0.305: v49.06,55.8 49.01,55.75 49.01,53.31 50.68,51.64 51.77,51.64 64.3,39.11 X1.2

### Text on the board
tPlace: GND | KB | CCW | CW | PWM | KA | MD | 3V | GND | R | SWC | SWD | L_3V | 3V | L_IO | GND | 5V | PWM | CW | CCW | FB | FB | CCW | CW | PWM | RX | TX | L_5V | M1 | M2 | PWM | CW | CCW | FB | GND | FB | ADC | M3 | CCW | 3V | CW | GND | PWM | 3V | M4 | LG